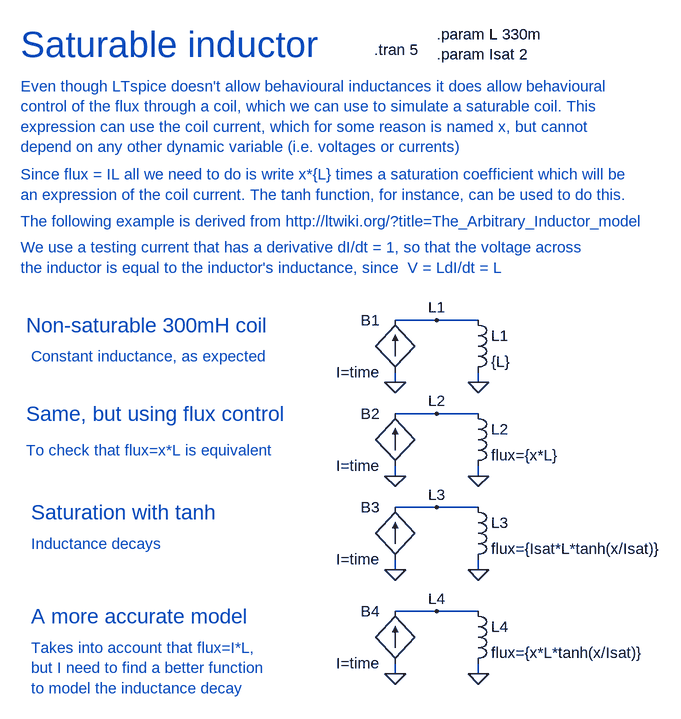
[diagram p0: schematic saturable inductor.asc]
saturable inductor.asc, the LTspice schematic file:
Version 4
SHEET 1 1232 924
WIRE 768 304 704 304
WIRE 832 304 768 304
WIRE 704 400 704 384
WIRE 832 400 832 384
WIRE 768 448 704 448
WIRE 832 448 768 448
WIRE 704 544 704 528
WIRE 832 544 832 528
WIRE 768 592 704 592
WIRE 832 592 768 592
WIRE 704 688 704 672
WIRE 832 688 832 672
WIRE 768 752 704 752
WIRE 832 752 768 752
WIRE 704 848 704 832
WIRE 832 848 832 832
FLAG 832 544 0
FLAG 704 544 0
FLAG 832 400 0
FLAG 704 400 0
FLAG 832 688 0
FLAG 704 688 0
FLAG 768 304 L1
FLAG 768 448 L2
FLAG 768 592 L3
FLAG 832 848 0
FLAG 704 848 0
FLAG 768 752 L4
SYMBOL ind 816 288 R0
SYMATTR InstName L1
SYMATTR Value {L}
SYMATTR SpiceLine Rser=1m
SYMBOL ind 816 432 R0
SYMATTR InstName L2
SYMATTR Value flux={x*L}
SYMBOL bi 704 384 R180
WINDOW 0 24 80 Left 2
WINDOW 3 24 0 Left 2
SYMATTR InstName B1
SYMATTR Value I=time
SYMBOL bi 704 528 R180
WINDOW 0 24 80 Left 2
WINDOW 3 24 0 Left 2
SYMATTR InstName B2
SYMATTR Value I=time
SYMBOL ind 816 576 R0
SYMATTR InstName L3
SYMATTR Value flux={Isat*L*tanh(x/Isat)}
SYMATTR SpiceLine Rser=1m
SYMBOL bi 704 672 R180
WINDOW 0 24 80 Left 2
WINDOW 3 24 0 Left 2
SYMATTR InstName B3
SYMATTR Value I=time
SYMBOL ind 816 736 R0
SYMATTR InstName L4
SYMATTR Value flux={x*L*tanh(x/Isat)}
SYMATTR SpiceLine Rser=1m
SYMBOL bi 704 832 R180
WINDOW 0 24 80 Left 2
WINDOW 3 24 0 Left 2
SYMATTR InstName B4
SYMATTR Value I=time
TEXT 672 -112 Left 2 !.tran 5
TEXT 128 -120 Left 5 ;Saturable inductor
TEXT 128 -56 Left 2 ;Even though LTspice doesn't allow behavioural inductances it does allow behavioural\ncontrol of the flux through a coil, which we can use to simulate a saturable coil. This\nexpression can use the coil current, which for some reason is named x, but cannot\ndepend on any other dynamic variable (i.e. voltages or currents)
TEXT 128 80 Left 2 ;Since flux = IL all we need to do is write x*{L} times a saturation coefficient which will be\nan expression of the coil current. The tanh function, for instance, can be used to do this.
TEXT 768 -136 Left 2 !.param L 330m\n.param Isat 2
TEXT 128 152 Left 2 ;The following example is derived from http://ltwiki.org/?title=The_Arbitrary_Inductor_model
TEXT 128 192 Left 2 ;We use a testing current that has a derivative dI/dt = 1, so that the voltage across\nthe inductor is equal to the inductor's inductance, since  V = LdI/dt = L
TEXT 136 312 Left 3 ;Non-saturable 300mH coil
TEXT 136 448 Left 3 ;Same, but using flux control
TEXT 144 360 Left 2 ;Constant inductance, as expected
TEXT 136 504 Left 2 ;To check that flux=x*L is equivalent
TEXT 144 600 Left 3 ;Saturation with tanh
TEXT 144 648 Left 2 ;Inductance decays
TEXT 144 760 Left 3 ;A more accurate model
TEXT 144 808 Left 2 ;Takes into account that flux=I*L, \nbut I need to find a better function \nto model the inductance decay

The netlist it stands for:
* saturable inductor.asc
L1 L1 0 {L} Rser=1m
L2 L2 0 flux={x*L}
B1 0 L1 I=time
B2 0 L2 I=time
L3 L3 0 flux={Isat*L*tanh(x/Isat)} Rser=1m
B3 0 L3 I=time
L4 L4 0 flux={x*L*tanh(x/Isat)} Rser=1m
B4 0 L4 I=time
.tran 5
* Saturable inductor
* Even though LTspice doesn't allow behavioural inductances it does allow behavioural
* control of the flux through a coil, which we can use to simulate a saturable coil. This
* expression can use the coil current, which for some reason is named x, but cannot
* depend on any other dynamic variable (i.e. voltages or currents)
* Since flux = IL all we need to do is write x*{L} times a saturation coefficient which will be
* an expression of the coil current. The tanh function, for instance, can be used to do this.
.param L 330m
.param Isat 2
* The following example is derived from http://ltwiki.org/?title=The_Arbitrary_Inductor_model
* We use a testing current that has a derivative dI/dt = 1, so that the voltage across
* the inductor is equal to the inductor's inductance, since  V = LdI/dt = L
* Non-saturable 300mH coil
* Same, but using flux control
* Constant inductance, as expected
* To check that flux=x*L is equivalent
* Saturation with tanh
* Inductance decays
* A more accurate model
* Takes into account that flux=I*L,
* but I need to find a better function
* to model the inductance decay
.backanno
.end